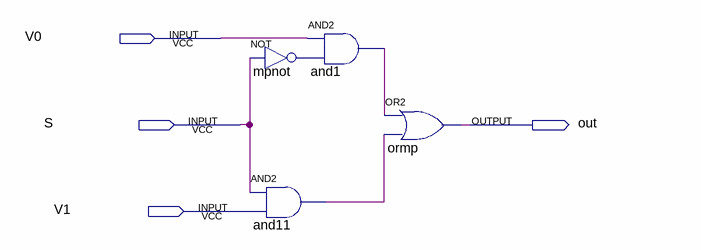
[diagram p0: schematic sheet]
// Quartus schematic 01selector.bdf as structural Verilog: 4 symbols, 4 pins
module \01selector  (
  input  V0,
  input  S,
  input  V1,
  output out
);

  wire and1_out, and11_out, mpnot_out;

  not mpnot (mpnot_out, S);
  and and11 (and11_out, S, V1);
  and and1 (and1_out, V0, mpnot_out);
  or ormp (out, and1_out, and11_out);
endmodule
